# EAGLE schematic pcm2704_CMoy (EAGLE 6.5.0)
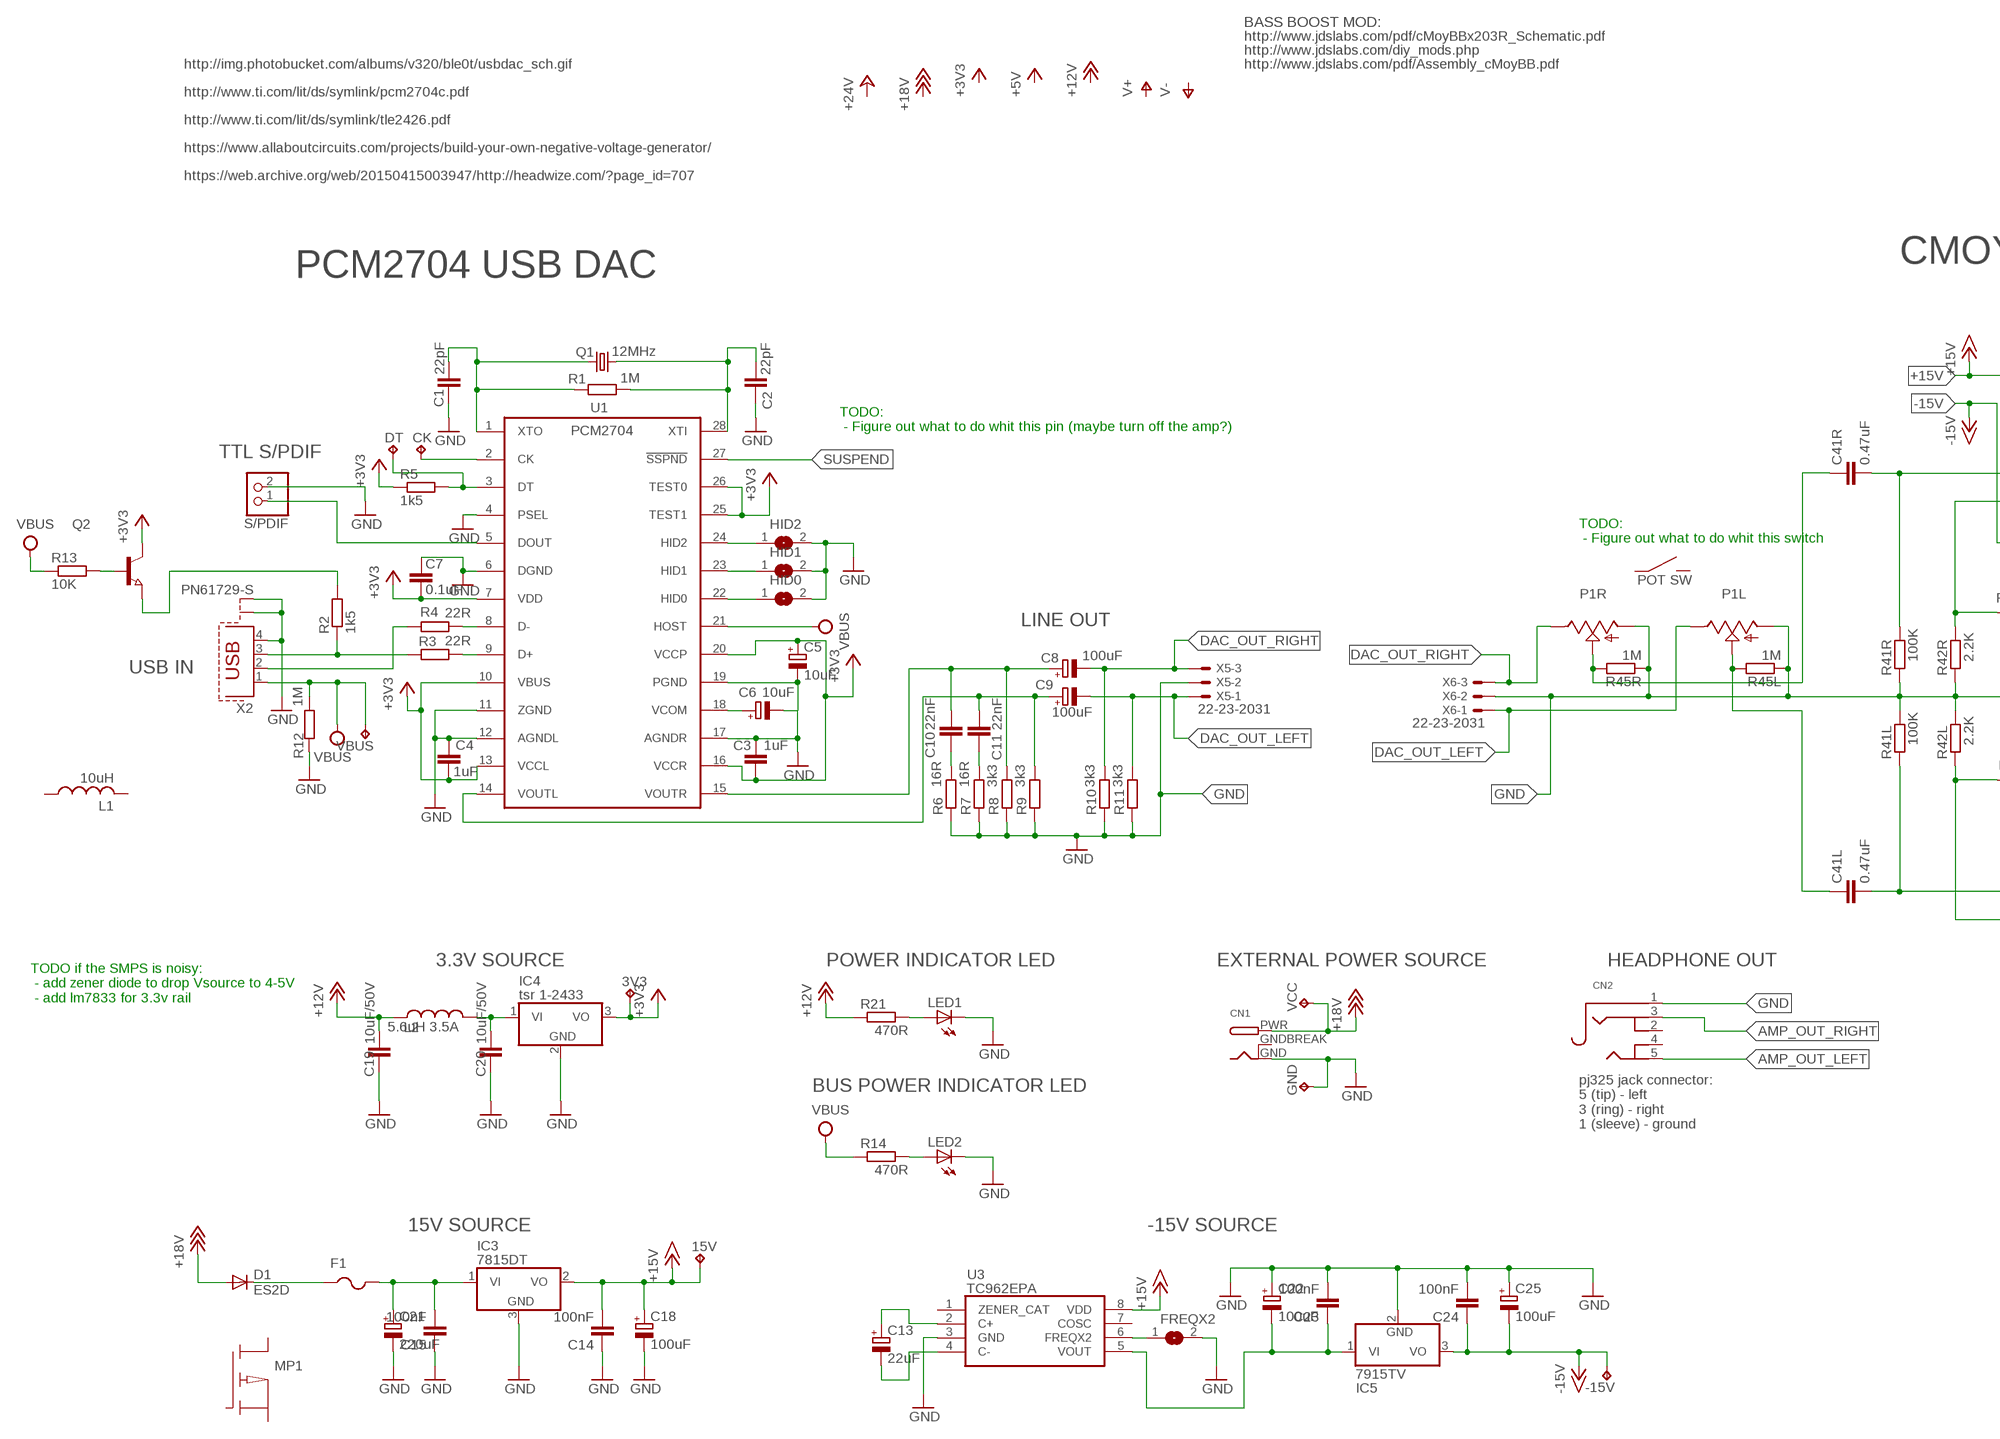
[diagram p0: schematic, sheet 1, part 1 of 2]
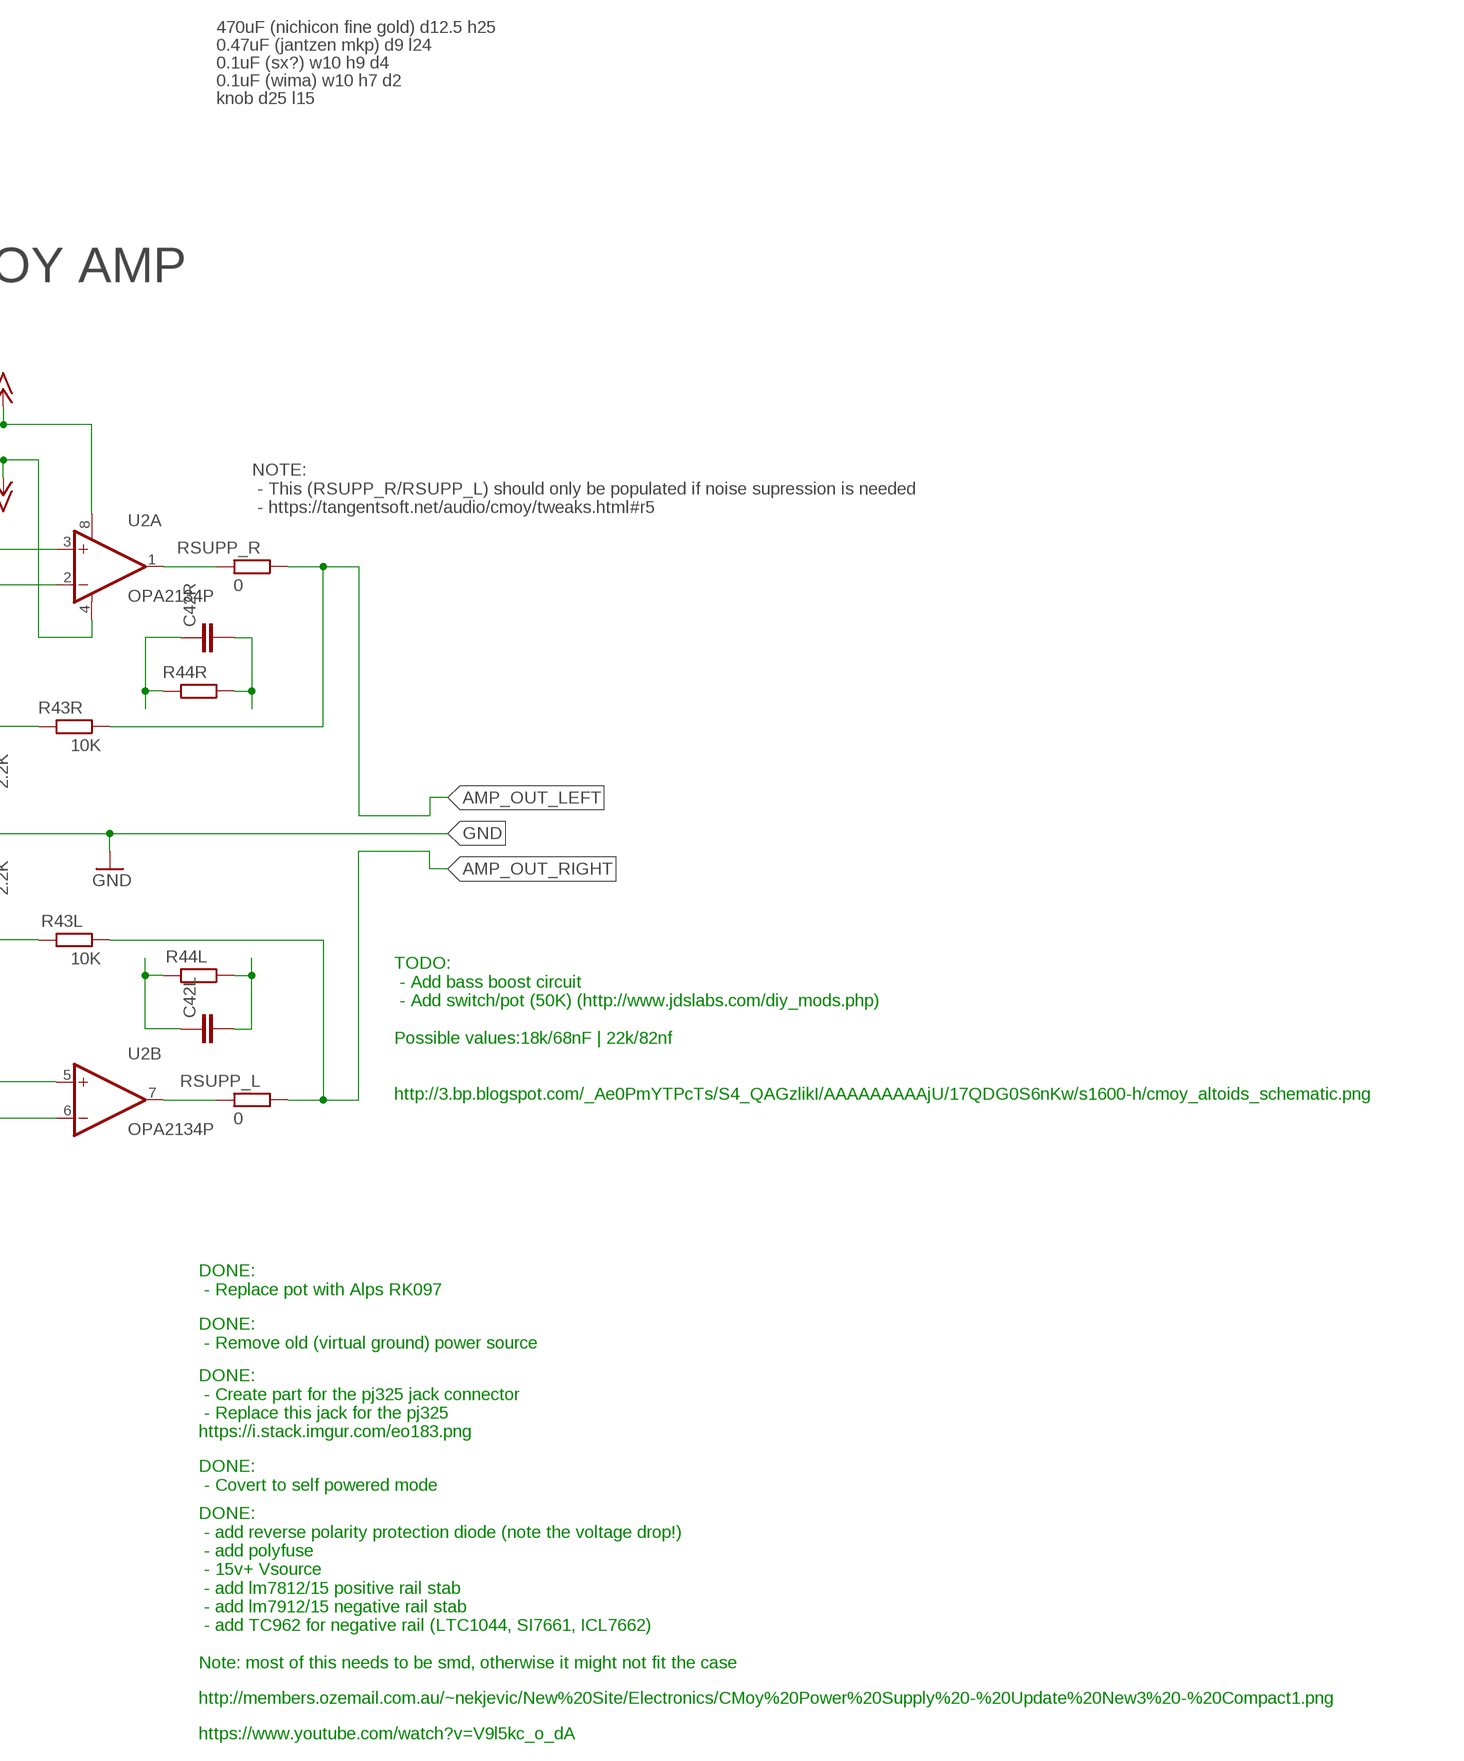
[diagram p1: schematic, sheet 1, part 2 of 2]

## Parts
3V3  TPTP20R  [TP20R]
15V  TPTP20R  [TP20R]
-15V  TPTP20R  [TP20R]
C1  22pF  C-EUC0805  [C0805]
C2  22pF  C-EUC0805  [C0805]
C3  1uF  C-EUC0805  [C0805]
C4  1uF  C-EUC0805  [C0805]
C5  10uF  CPOL-EUE2.5-7  [E2,5-7]
C6  10uF  CPOL-EUE2.5-7  [E2,5-7]
C7  0.1uF  C-EUC0805  [C0805]
C8  100uF  CPOL-EUE3.5-10  [E3,5-10]
C9  100uF  CPOL-EUE3.5-10  [E3,5-10]
C10  22nF  C-EU050-025X075  [C050-025X075]
C11  22nF  C-EU050-025X075  [C050-025X075]
C13  22uF  CPOL-EUE2.5-7  [E2,5-7]
C14  100nF  C-EUC1206  [C1206]
C15  100nF  C-EUC1206  [C1206]
C18  100uF  CPOL-EUE2.5-7  [E2,5-7]
C19  10uF/50V  C-EUC1206  [C1206]
C20  10uF/50V  C-EUC1206  [C1206]
C21  220uF  CPOL-EUE2.5-7  [E2,5-7]
C22  100uF  CPOL-EUE2.5-7  [E2,5-7]
C23  100nF  C-EUC1206  [C1206]
C24  100nF  C-EUC1206  [C1206]
C25  100uF  CPOL-EUE2.5-7  [E2,5-7]
C41L  0.47uF  C27/11  [C27.5B11]
C41R  0.47uF  C27/11  [C27.5B11]
C42L  C7.5/4  [C7.5B4]
C42R  C7.5/4  [C7.5B4]
CK  TPTP20R  [TP20R]
CN1  DCBARRELPTH  [DCJACK_2MM_PTH]
CN2  AUDIO_3.5MMJACKPTH  [4UCONN_05550]
D1  ES2D  [SMB]
DT  TPTP20R  [TP20R]
F1  PTCFUSE-1812  [1812]
FREQX2  SJ  [SJ]
GND  TPTP20R  [TP20R]
HID0  SJ  [SJ]
HID1  SJ  [SJ]
HID2  SJ  [SJ]
IC3  7815DT  [TO252]
IC4  tsr 1-2433  7805TV  [TO220V]
IC5  7915TV  7815TV  [TO220V]
L1  10uH  L-USL1812  [L1812]
L2  5.6uH 3.5A  L-USL1812  [L1812]
LED1  LED3MM  [LED3MM]
LED2  LED3MM  [LED3MM]
MP1  PMOS  [SOT23]
P1  ALPS_RK0971221Z0N  [ALPS_RK0971221Z0X]
Q1  12MHz  CRYSTALHC49S  [HC49/S]
Q2  NPN-TRANSISTOR_SOT23  [SOT23]
R1  1M  R-EU_M0805  [M0805]
R2  1k5  R-EU_R0805  [R0805]
R3  22R  R-EU_R0805  [R0805]
R4  22R  R-EU_R0805  [R0805]
R5  1k5  R-EU_R0805  [R0805]
R6  16R  R-EU_0204/7  [0204/7]
R7  16R  R-EU_0204/7  [0204/7]
R8  3k3  R-EU_0204/7  [0204/7]
R9  3k3  R-EU_0204/7  [0204/7]
R10  3k3  R-EU_0204/7  [0204/7]
R11  3k3  R-EU_0204/7  [0204/7]
R12  1M  R-EU_M0805  [M0805]
R13  10K  R-EU_R0805  [R0805]
R14  470R  R-EU_0204/7  [0204/7]
R21  470R  R-EU_0204/7  [0204/7]
R41L  100K  R-EU_0204/7  [0204/7]
R41R  100K  R-EU_0204/7  [0204/7]
R42L  2.2K  R-EU_0204/7  [0204/7]
R42R  2.2K  R-EU_0204/7  [0204/7]
R43L  10K  R-EU_0204/7  [0204/7]
R43R  10K  R-EU_0204/7  [0204/7]
R44L  R-EU_0204/7  [0204/7]
R44R  R-EU_0204/7  [0204/7]
R45L  1M  R-EU_0204/7  [0204/7]
R45R  1M  R-EU_0204/7  [0204/7]
RSUPP_L  0  R-EU_0204/7  [0204/7]
RSUPP_R  0  R-EU_0204/7  [0204/7]
S/PDIF  PINHD-1X2  [1X02]
U1  PCM2704  [SSOP28DB]
U2  OPA2134P  [DIL08]
U3  TC962EPA  [PDIP8_300MC]
VBUS  TPTP20R  [TP20R]
VCC  TPTP20R  [TP20R]
X2  PN61729-S  [PN61729-S]
X5  22-23-2031  [22-23-2031]
X6  22-23-2031  [22-23-2031]

## Nets
+3V3: 3V3.TP C3.1 C4.2 C5.+ C7.2 IC4.3(VO) Q2.3(C) R5.1 U1.7(VDD) U1.10(VBUS) U1.13(VCCL) U1.16(VCCR) U1.20(VCCP) U1.25(TEST1) U1.26(TEST0)
+12V: C19.2 L2.1 R21.1
+15V: 15V.TP C14.2 C18.+ IC3.2(VO) U2.8(A:V+) U3.8(VDD)
+18V: CN1.PWR D1.A VCC.TP
-15V: -15V.TP C24.1 C25.- IC5.3(VO) U2.4(A:V-)
AMP_OUT_LEFT: CN2.5 R43R.1 RSUPP_R.1
AMP_OUT_RIGHT: CN2.3 R43L.1 RSUPP_L.1
DAC_OUT_LEFT: C9.- P1.I1 R11.2 X5.1 X6.1
DAC_OUT_RIGHT: C8.- P1.I2 R10.2 X5.3 X6.3
GND: C1.2 C2.2 C3.2 C4.1 C5.- C6.- C7.1 C14.1 C15.1 C18.- C19.1 C20.1 C21.- C22.+ C23.2 C24.2 C25.+ CN1.GND CN2.1 FREQX2.2 GND.TP HID0.2 HID1.2 HID2.2 IC3.3(GND) IC4.2(GND) IC5.2(GND) LED1.K(C) LED2.K(C) P1.G1 P1.G2 R6.1 R7.1 R8.1 R9.1 R10.1 R11.1 R12.1 R41L.2 R41R.1 R42L.2 R42R.1 R45L.1 R45R.1 S/PDIF.2 U1.4(PSEL) U1.6(DGND) U1.11(ZGND) U1.12(AGNDL) U1.17(AGNDR) U1.19(PGND) U3.3(GND) X2.4 X2.S1 X2.S2 X5.2 X6.2
N$1: D1.C F1.1
N$2: LED2.A R14.2
N$3: R4.1 X2.2
N$4: R4.2 U1.8(D-)
N$5: R2.1 R3.1 X2.3
N$6: R3.2 U1.9(D+)
N$7: C20.2 IC4.1(VI) L2.2
N$8: LED1.A R21.2
N$9: CK.TP U1.2(CK)
N$10: C1.1 Q1.1 R1.1 U1.1(XTO)
N$11: C2.1 Q1.2 R1.2 U1.28(XTI)
N$12: HID2.1 U1.24(HID2)
N$13: C42L.2 R44L.1
N$14: C42L.1 R44L.2
N$15: HID1.1 U1.23(HID1)
N$16: HID0.1 U1.22(HID0)
N$17: C41L.2 R41L.1 U2.5(B:+IN)
N$18: C41R.2 R41R.2 U2.3(A:+IN)
N$19: C41R.1 P1.O2 R45R.2
N$20: DT.TP R5.2 U1.3(DT)
N$21: C41L.1 P1.O1 R45L.2
N$22: R42R.2 R43R.2 U2.2(A:-IN)
N$23: R42L.1 R43L.2 U2.6(B:-IN)
N$24: C15.2 C21.+ F1.2 IC3.1(VI)
N$25: FREQX2.1 U3.6(FREQX2)
N$26: C10.2 R6.2
N$27: C11.2 R7.2
N$28: C8.+ C10.1 R8.2 U1.15(VOUTR)
N$29: C9.+ C11.1 R9.2 U1.14(VOUTL)
N$30: C13.+ U3.2(C+)
N$31: C13.- U3.4(C-)
N$32: S/PDIF.1 U1.5(DOUT)
N$33: RSUPP_R.2 U2.1(A:OUT)
N$34: C22.- C23.1 IC5.1(VI) U3.5(VOUT)
N$35: RSUPP_L.2 U2.7(B:OUT)
N$36: C42R.1 R44R.2
N$37: C42R.2 R44R.1
N$38: Q2.1(B) R13.2
N$39: Q2.2(E) R2.2
SUSPEND: U1.27(!SSPND)
VBUS: R12.2 R13.1 R14.1 U1.21(HOST) VBUS.TP X2.1
VCOM: C6.+ U1.18(VCOM)
Unconnected: CN2.2 CN2.4 L1.1 L1.2 MP1.1(G) MP1.2(S) MP1.3(D) U3.1(ZENER_CAT) U3.7(COSC)

## Notes on the sheet
- BASS BOOST MOD:
- http://www.jdslabs.com/pdf/cMoyBBx203R_Schematic.pdf
- http://www.jdslabs.com/diy_mods.php
- http://img.photobucket.com/albums/v320/ble0t/usbdac_sch.gif | http://www.jdslabs.com/pdf/Assembly_cMoyBB.pdf | 470uF (nichicon fine gold) d12.5 h25
- 0.47uF (jantzen mkp) d9 l24
- http://www.ti.com/lit/ds/symlink/pcm2704c.pdf | 0.1uF (sx?) w10 h9 d4
- 0.1uF (wima) w10 h7 d2
- http://www.ti.com/lit/ds/symlink/tle2426.pdf | knob d25 l15
- https://www.allaboutcircuits.com/projects/build-your-own-negative-voltage-generator/
- https://web.archive.org/web/20150415003947/http://headwize.com/?page_id=707
- CMOY AMP
- PCM2704 USB DAC
- TODO:
   - Figure out what to do whit this pin (maybe turn off the amp?)
- NOTE:
   - This (RSUPP_R/RSUPP_L) should only be populated if noise supression is needed
   - https://tangentsoft.net/audio/cmoy/tweaks.html#r5
- TTL S/PDIF
- TODO:
   - Figure out what to do whit this switch
- LINE OUT
- USB IN
- TODO:
   - Add bass boost circuit
   - Add switch/pot (50K) (http://www.jdslabs.com/diy_mods.php)
  
  Possible values:18k/68nF | 22k/82nf
  
  
  http://3.bp.blogspot.com/_Ae0PmYTPcTs/S4_QAGzlikI/AAAAAAAAAjU/17QDG0S6nKw/s1600-h/cmoy_altoids_schematic.png
- 3.3V SOURCE | POWER INDICATOR LED | EXTERNAL POWER SOURCE | HEADPHONE OUT
- TODO if the SMPS is noisy:
   - add zener diode to drop Vsource to 4-5V
   - add lm7833 for 3.3v rail
- DONE:
   - Replace pot with Alps RK097
- BUS POWER INDICATOR LED
- DONE:
   - Remove old (virtual ground) power source
- pj325 jack connector:
  5 (tip) - left
  3 (ring) - right
  1 (sleeve) - ground
- DONE:
   - Create part for the pj325 jack connector
   - Replace this jack for the pj325
  https://i.stack.imgur.com/eo183.png
- DONE:
   - Covert to self powered mode
- 15V SOURCE | -15V SOURCE
- DONE:
   - add reverse polarity protection diode (note the voltage drop!)
   - add polyfuse
   - 15v+ Vsource
   - add lm7812/15 positive rail stab
   - add lm7912/15 negative rail stab
   - add TC962 for negative rail (LTC1044, SI7661, ICL7662)
  
  Note: most of this needs to be smd, otherwise it might not fit the case
- http://members.ozemail.com.au/~nekjevic/New%20Site/Electronics/CMoy%20Power%20Supply%20-%20Update%20New3%20-%20Compact1.png
- https://www.youtube.com/watch?v=V9l5kc_o_dA

## Power pins joined to a net without a drawn wire
GNDBREAK: CN1.GNDBREAK
S1: P1.S1
S2: P1.S2

## Library data of the parts
3V3 15V -15V CK DT GND VBUS VCC = testpad:TP: Test pad
C1-C4 C7 C10 C11 C14 C15 C19 C20 C23 C24 = rcl:C-EU: CAPACITOR, European symbol
C5 = qfm-trx1-24g:CPOL-EU: POLARIZED CAPACITOR, European symbol
C6 C8 C9 C13 C18 C21 C22 C25 = rcl:CPOL-EU: POLARIZED CAPACITOR, European symbol
C41L C41R C42L C42R = capacitor-wima:C: CAPACITOR naming: grid - package width
CN1 = adafruit:DCBARREL: 2.0mm DC Barrel Jack DCJACK_2MM_PTH - Through Hole Jack (4UConnector: 05537)
CN2 = microbuilder:AUDIO_3.5MMJACK: 3.5MM Audio Jack These are normally connected as follows, from left-to right on the schematic symbol above: Tip: Left Audio Inner Ring: Right Audio Shell: Common/GND
D1 = diode:ES2D: DIODE super fast rectifier, 2 A
F1 = adafruit:PTCFUSE: PTC fuses, resettable thermistors
FREQX2 HID0 HID1 HID2 = jumper:SJ: SMD solder JUMPER
IC3-IC5 = linear:78*: Positive VOLTAGE REGULATOR Source: http://cache.national.com/ds/LM/LM78L05.pdf http://www.fairchildsemi.com/ds/LM/LM7805.pdf
L1 L2 = rcl:L-US: INDUCTOR, American symbol
LED1 LED2 = led:LED: LED OSRAM: - CHIPLED LG R971, LG N971, LY N971, LG Q971, LY Q971, LO R971, LY R971 LH N974, LH R974 LS Q976, LO Q976, LY Q976 LO Q996 - Hyper CHIPLED LW Q18S LB Q993, LB Q99A, LB R99A - SideLED LS A670, LO A670, LY A670, LG A670, LP A670 LB A673, LV A673, LT A673, LW A673 LH A674 LY A675 LS A676, LA A676, LO A676, LY A676, LW A676 LS A679, LY A679, LG A679 - Hyper Micro SIDELED® LS Y876, LA Y876, LO Y876, LY Y876 LT Y87S - SmartLED LW L88C, LW L88S LB L89C, LB L89S, LG L890 LS L89K, LO L89K, LY L89K LS L896, LA L896, LO L896, LY L896 - TOPLED LS T670, LO T670, LY T670, LG T670, LP T670 LSG T670, LSP T670, LSY T670, LOP T670, LYG T670 LG T671, LOG T671, LSG T671 LB T673, LV T673, LT T673, LW T673 LH T674 LS T676, LA T676, LO T676, LY T676, LB T676, LH T676, LSB T676, LW T676 LB T67C, LV T67C, LT T67C, LS T67K, LO T67K, LY T67K, LW E67C LS E67B, LA E67B, LO E67B, LY E67B, LB E67C, LV E67C, LT E67C LW T67C LS T679, LY T679, LG T679 LS T770, LO T770, LY T770, LG T770, LP T770 LB T773, LV T773, LT T773, LW T773 LH T774 LS E675, LA E675, LY E675, LS T675 LS T776, LA T776, LO T776, LY T776, LB T776 LHGB T686 LT T68C, LB T68C - Hyper Mini TOPLED® LB M676 - Mini TOPLED Santana® LG M470 LS M47K, LO M47K, LY M47K Source: http://www.osram.convergy.de LUXEON: - LUMILED® LXK2-PW12-R00, LXK2-PW12-S00, LXK2-PW14-U00, LXK2-PW14-V00 LXK2-PM12-R00, LXK2-PM12-S00, LXK2-PM14-U00 LXK2-PE12-Q00, LXK2-PE12-R00, LXK2-PE12-S00, LXK2-PE14-T00, LXK2-PE14-U00 LXK2-PB12-K00, LXK2-PB12-L00, LXK2-PB12-M00, LXK2-PB14-N00, LXK2-PB14-P00, LXK2-PB14-Q00 LXK2-PR12-L00, LXK2-PR12-M00, LXK2-PR14-Q00, LXK2-PR14-R00 LXK2-PD12-Q00, LXK2-PD12-R00, LXK2-PD12-S00 LXK2-PH12-R00, LXK2-PH12-S00 LXK2-PL12-P00, LXK2-PL12-Q00, LXK2-PL12-R00 Source: www.luxeon.com KINGBRIGHT: KA-3528ASYC Source: www.kingbright.com
MP1 = sym:PMOS: P-Channel MOSFET transistor
P1 = audio-pots:ALPS_RK0971221Z0*: ALPS RK0971221Z Dual-gang 9mm potentiometer for volume control, with SPST switch -05 model: 10K with "volume" taper -0N model: 50K with traditional audio taper
Q1 = crystal:CRYSTAL: CRYSTAL
Q2 = semicon-smd-ipc:NPN-TRANSISTOR_: NPN TRANSISTOR
R1-R14 R21 R41L R41R R42L R42R R43L R43R R44L R44R R45L R45R RSUPP_L RSUPP_R = rcl:R-EU_: RESISTOR, European symbol
S/PDIF = pinhead:PINHD-1X2: PIN HEADER
U1 = pavouk:PCM2704: STEREO AUDIO DAC WITH USB INTERFACE, SINGLE-ENDED HEADPHONE OUTPUT AND S/PDIF OUTPUT
U2 = burr-brown:OPA2134: Operational Amplifier; MF: TEXAS INSTRUMENTS; MPN: OPA2134PA; OC_FARNELL: 1097574; OC_NEWARK: 74K3897
U3 = microchip-chargepump:TC962EPA: High Current Charge Pump DC-to-DC Converter
X2 = con-berg:PN61729-S: BERG USB connector; OC_FARNELL: unknown; OC_NEWARK: unknown
X5 X6 = con-molex:22-23-2031: .100" (2.54mm) Center Header - 3 Pin; MF: MOLEX; MPN: 22-23-2031; OC_FARNELL: 1462950; OC_NEWARK: 30C0862